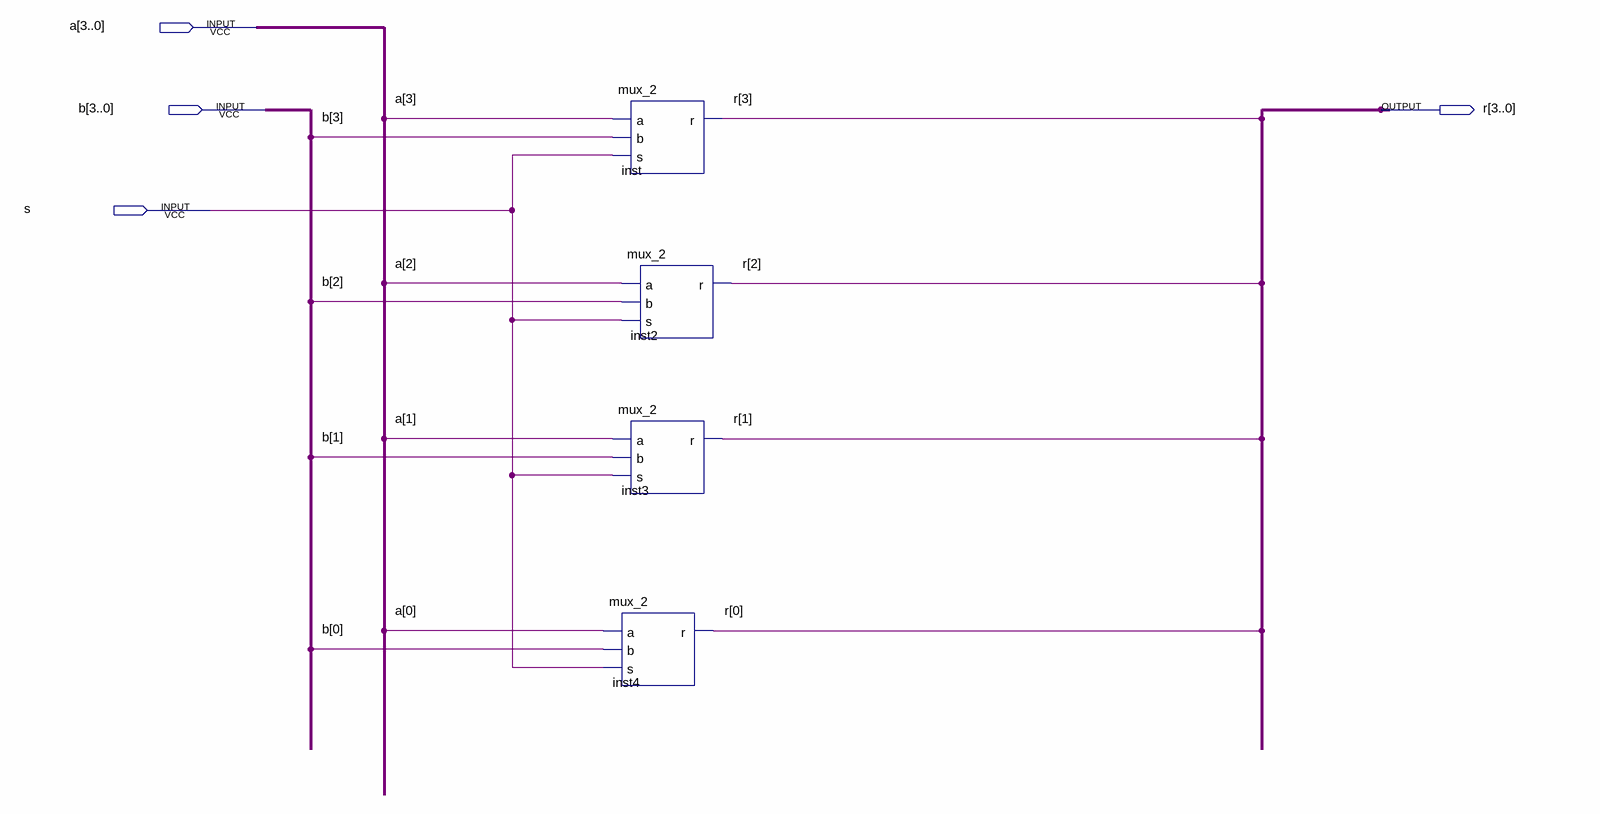
[diagram p0: schematic sheet]
// Quartus schematic mux_1s.bdf as structural Verilog: 4 symbols, 4 pins
module mux_1s (
  input  [3:0] a,
  input  [3:0] b,
  input  s,
  output [3:0] r
);

  mux_2 inst (.a(a[3]), .b(b[3]), .s(s), .r(r[3]));
  mux_2 inst2 (.a(a[2]), .b(b[2]), .s(s), .r(r[2]));
  mux_2 inst3 (.a(a[1]), .b(b[1]), .s(s), .r(r[1]));
  mux_2 inst4 (.a(a[0]), .b(b[0]), .s(s), .r(r[0]));
endmodule
